# Altium project MIA_task_11.PrjPcb
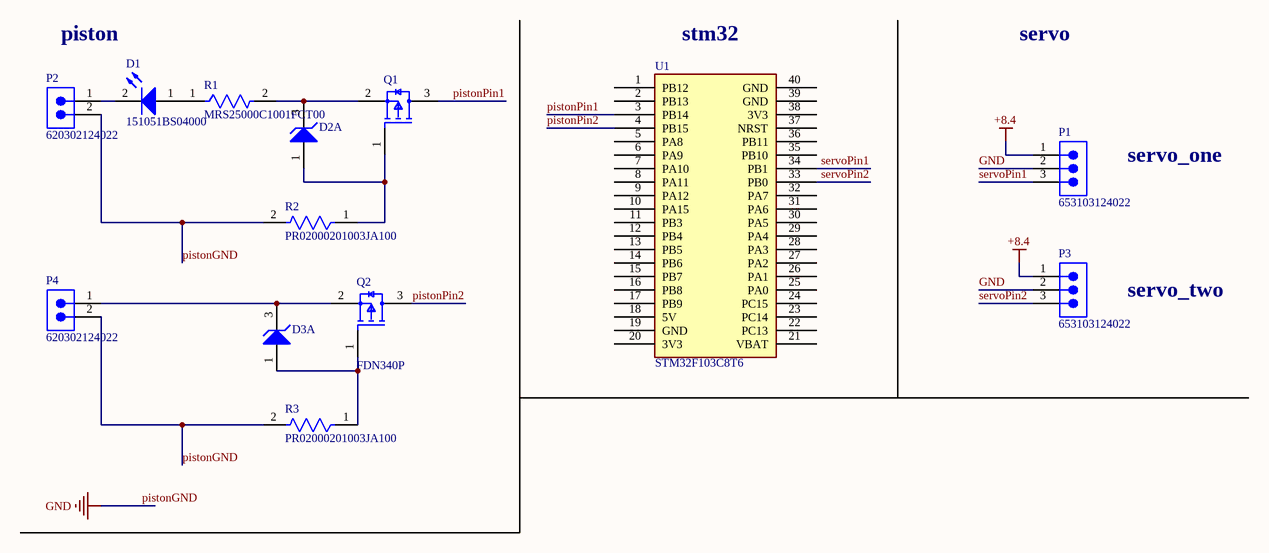
[diagram p0: Sheet1.SchDoc]
1 sheet, 13 parts. Net scope: global (net labels, ports and power ports of the same name join across sheets).
Board file: PCB1.PcbDoc

## Sheet Sheet1.SchDoc
size A; SheetNumber: 1; SheetTotal: 1

### Parts
D1  151051BS04000  [WL-TMRC_D5.9H8.7]
D2  BZX84C6V2LT1G  [ONSC-SOT-23-3-318-08_V]  (value not drawn)  (part A of 2)
D3  BZX84C6V2LT1G  [ONSC-SOT-23-3-318-08_V]  (value not drawn)  (part A of 2)
P1  653103124022  [653103124022]
P2  620302124022  [620302124022]
P3  653103124022  [653103124022]
P4  620302124022  [620302124022]
Q1  FDN340P  [FP-527AG-MFG]  (value not drawn)
Q2  FDN340P  [FP-527AG-MFG]
R1  MRS25000C1001FCT00  [FP-MRS25-MFG]
R2  PR02000201003JA100  [FP-PR02000201003JA100-MFG]
R3  PR02000201003JA100  [FP-PR02000201003JA100-MFG]
U1  STM32F103C8T6  [Stm32 BluePill]

### Nets
+8.4: P1.1 P3.1
GND: P1.2 P2.2 P3.2 P4.2 R2.2 R3.2  [also labelled pistonGND]
pistonPin1: Q1.3(D) U1.3(PB14)
pistonPin2: Q2.3(D) U1.4(PB15)
servoPin1: P1.3 U1.34(PB1)
servoPin2: P3.3 U1.33(PB0)
NetD1_1: D1.1(A) R1.1
NetD1_2: D1.2(K) P2.1
NetD2_1: D2.1(A) Q1.1(G) R2.1
NetD2_3: D2.3(K) Q1.2(S) R1.2
NetD3_1: D3.1(A) Q2.1(G) R3.1
NetD3_3: D3.3(K) P4.1 Q2.2(S)

Not connected (* = marked no-connect by the designer): U1 1(PB12) 2(PB13) 5(PA8) 6(PA9) 7(PA10) 8(PA11) 9(PA12) 10(PA15) 11(PB3) 12(PB4) 13(PB5) 14(PB6) 15(PB7) 16(PB8) 17(PB9) 18(5V) 19(GND) 20(3V3) 21(VBAT) 22(PC13) 23(PC14) 24(PC15) 25(PA0) 26(PA1) 27(PA2) 28(PA3) 29(PA4) 30(PA5) 31(PA6) 32(PA7) 35(PB10) 36(PB11) 37(NRST) 38(3V3) 39(GND) 40(GND)

### Notes on the sheet
- piston
- (near U1) stm32
- servo
- servo_one
- servo_two

### Library data of the parts
D1 = CMP-1488-00009-2: NexarPartId: 29717812; Test Current: 20mA; Forward Voltage: 3.2V; Wavelength: 470nm; Lens Size: 5mm; Lens Style: Circular, Diffused, Round; Forward Current: 100mA; Peak Wavelength: 465nm; Viewing Angle: 40°; Luminous Intensity: 500mcd; Max Reverse Voltage (DC): 5V; Color: Blue; Case/Package: Radial; Width: 5mm; Mount: Through Hole; Min Operating Temperature: -40°C; Length: 5mm; Height: 8.6mm; Max Operating Temperature: 85°C; Packaging: Bulk; RoHS: Compliant; REACH SVHC: Unknown; Dominant Wavelength: 470nm
D2 D3 = CMP-1060-00914-1: Zener Voltage Regulator, 225 mW, 3-Pin SOT-23, Pb-Free, Tape and Reel; Manufacturer: On Semiconductor; ComponentLink1Description: Manufacturer URL; PackageReference: SOT-23-3-318-08; ComponentLink1URL: http://www.onsemi.com/; Mounting Technology: Surface Mount; DatasheetVersion: Rev. 17; ComponentLink3Description: Package Specification; PackageVersion: Rev. AP, 11/2009; ComponentLink2URL: http://www.onsemi.com/pub_link/Collateral/BZX84C2V4LT1-D.PDF; Packing: Tape and Reel; ComponentLink2Description: Datasheet; RoHS: Pb-Free; PartNumber: BZX84C6V2LT1G; ComponentLink3URL: http://www.onsemi.cn/pub_link/Collateral/318-08.PDF; PackageDescription: 3-Pin Small Outline Transistor, Body 2.92 x 1.3 mm, Pitch 0.95 mm
P1 P3 = CMP-1502-00758-2: NexarPartId: 18818275; Insulation Resistance: 100MΩ; Gender: Male; Connector Type: Male Pin; Insulation: Insulated; Number of Positions: 3; Current Rating: 1A; Voltage Rating: 125V; Contact Resistance: 20mΩ; Pitch: 1.25mm; Contact Gender: Male; Length: 8.5mm; Number of Pins: 3; Min Operating Temperature: -40°C; Contact Material: Copper; Lead Pitch: 1.25mm; Flammability Rating: UL94 V-0; RoHS: Compliant; Number of Contacts: 3; REACH SVHC: Unknown; Orientation: Vertical; Contact Plating: Tin; Max Operating Temperature: 85°C; Height: 4.75mm; Mount: Surface Mount; Packaging: Tape and Reel; Housing Material: Nylon; Color: Beige, White; Number of Rows: 1; Operating Supply Voltage: 125V; Width: 8.5mm; Termination: SMD/SMT; Contact Mating Length: 2.159mm
P2 P4 = CMP-1502-00660-2: NexarPartId: 18818242; Insulation: Insulated; Connector Type: Male Pin; Pitch: 2mm; Insulation Resistance: 1GΩ; Gender: Male; Voltage Rating: 125V; Number of Positions: 2; Contact Resistance: 20mΩ; Operating Supply Voltage: 100V; Current Rating: 2A; Contact Material: Copper; Number of Rows: 1; Flammability Rating: UL94 V-0; Housing Material: Nylon; Lead Pitch: 2mm; Orientation: Vertical; Max Operating Temperature: 85°C; Termination: SMD/SMT; REACH SVHC: Unknown; Contact Mating Length: 3.5052mm; RoHS: Compliant; Packaging: Tape and Reel; Number of Contacts: 2; Height: 6.6mm; Mount: Surface Mount; Number of Pins: 2; Contact Gender: Male; Min Operating Temperature: -40°C; Length: 5mm; Width: 7.9mm; Contact Plating: Tin; Color: Beige, White
Q1 Q2 = CMP-2100-03638-2: MOSFET P-CH 20V 2A SSOT3; Fall Time: 11ns; Rise Time: 9ns; Voltage Rating (DC): -20V; Power Dissipation: 500mW; Nominal Vgs: -800mV; Current Rating: -2A; Gate to Source Voltage (Vgs): 8V; Rds On Max: 70mR; Turn-Off Delay Time: 27ns; Element Configuration: Single; Number of Elements: 1; Input Capacitance: 779pF; Drain to Source Resistance: 60mR; Turn-On Delay Time: 10ns; Package Quantity: 1; Mount: Surface Mount; Case/Package: SOT-23; Min Operating Temperature: -55°C; REACH SVHC: No SVHC; Weight: 0.03g; Packaging: Tape and Reel; Threshold Voltage: -800mV; Max Operating Temperature: 150°C; Dual Supply Voltage: -20V; Termination: SMD/SMT; Drain to Source Voltage (Vdss): 20V; Height: 0.94mm; Length: 2.92mm; Contact Plating: Tin; Width: 3.05mm; Drain to Source Breakdown Voltage: -20V; Max Power Dissipation: 500mW; Continuous Drain Current (ID): 2A; Number of Pins: 3; Lead Free: Lead Free; Radiation Hardening: No; On-State Resistance: 70MR
R1 = CMP-02408-000051-1: RES 1K OHM 0.6W 1% AXIAL; Power Rating: 600mW; Lead Diameter: 0.6mm; Voltage Rating (DC): 350V; Resistance: 1kR; Temperature Coefficient: 50ppm/°C; Width: 2.5mm; Military Standard: Not; Package Quantity: 5000; Radiation Hardening: No; Case/Package: Axial; Resistance Tolerance: 1%; Resistor Type: Metal Film; Contact Plating: Tin; Length: 6.5mm; Lead Free: Lead Free; RoHS Compliant: Yes; Mount: Through Hole; Number of Pins: 2; Technology: THIN FILM; Voltage Rating: 350V; Min Operating Temperature: -55°C; Weight: 0.00776oz; Diameter: 2.5mm; Construction: Cylindrical; Series: MRS25; Tolerance: 1%; Packaging: Tape and Reel; Max Operating Temperature: 155°C; Max Power Dissipation: 600mW; Number of Terminations: 2; Termination: Axial
R2 R3 = CMP-00030-42817933-1: PR02000201003JA100 Fixed Resistor, Metal Film, 2W, 100000ohm, 500V, 5% +/-Tol, 250ppm/Cel, Through Hole Mount; Resistance: 100kΩ; Temperature Coefficient: 250ppm/°C; Case/Package: Conformal; Lead Free: Lead Free; Composition: Metal Film; Schedule B: 8533210090, 8533210090; Tolerance: 5%; RoHS: Compliant; Min Operating Temperature: -55°C; NexarPartId: 42817933; Diameter: 3.9mm; Max Operating Temperature: 155°C; Voltage Rating: 500V; Length: 12mm; Width: 3.9mm; Contact Plating: Tin; REACH SVHC: No SVHC; Operating Supply Voltage: 500V; Termination: Axial; Power Rating: 2W; Military Standard: Not; Radiation Hardening: No; Mount: Through Hole; Voltage Rating (DC): 500V
U1 = BluePill: Designed By @Alixahedi